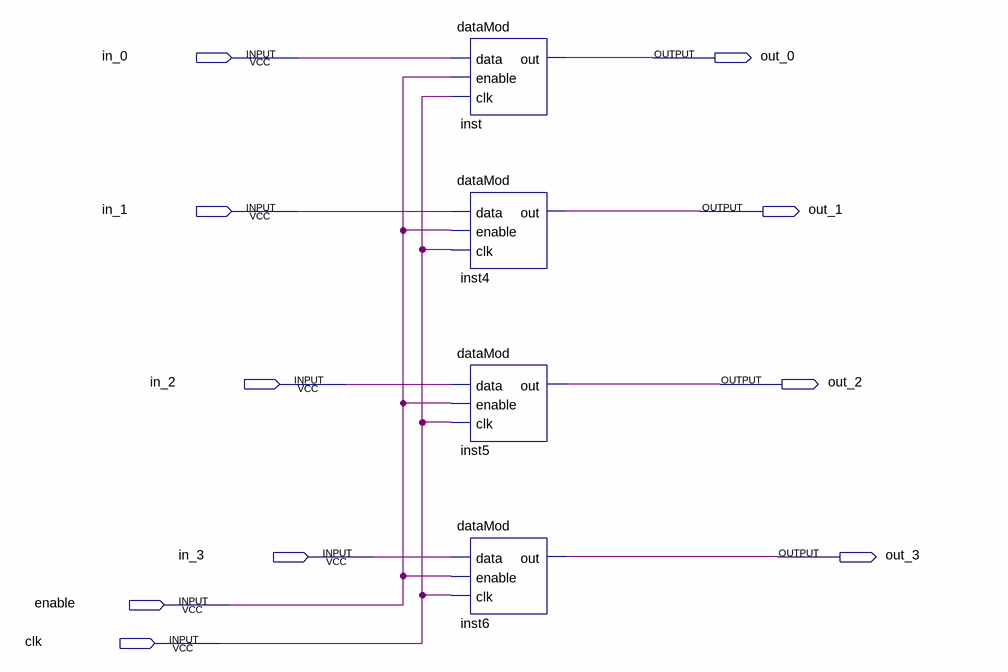
[diagram p0: schematic sheet]
// Quartus schematic num.bdf as structural Verilog: 4 symbols, 10 pins
module num (
  input  in_0,
  input  in_1,
  input  in_2,
  input  in_3,
  input  enable,
  input  clk,
  output out_0,
  output out_1,
  output out_2,
  output out_3
);

  dataMod inst (.data(in_0), .enable(enable), .clk(clk), .out(out_0));
  dataMod inst4 (.data(in_1), .enable(enable), .clk(clk), .out(out_1));
  dataMod inst5 (.data(in_2), .enable(enable), .clk(clk), .out(out_2));
  dataMod inst6 (.data(in_3), .enable(enable), .clk(clk), .out(out_3));
endmodule
